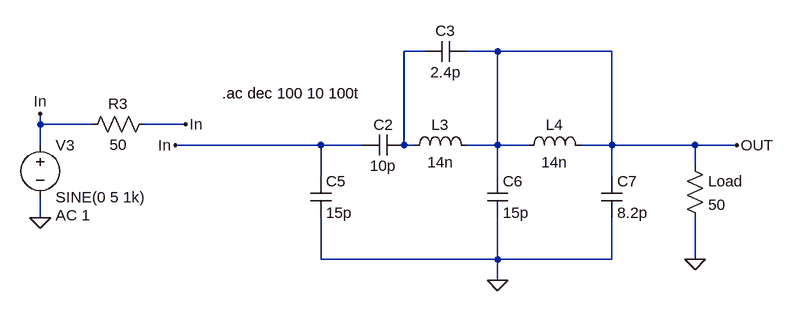
[diagram p0: schematic 433MHz filter with 14nH inductors.asc]
433MHz filter with 14nH inductors.asc, the LTspice schematic file:
Version 4
SHEET 1 2444 680
WIRE 752 32 720 32
WIRE 864 32 816 32
WIRE 1040 32 864 32
WIRE 160 144 160 128
WIRE 240 144 160 144
WIRE 384 144 320 144
WIRE 160 176 160 144
WIRE 592 176 368 176
WIRE 656 176 592 176
WIRE 720 176 720 32
WIRE 736 176 720 176
WIRE 864 176 864 32
WIRE 864 176 816 176
WIRE 912 176 864 176
WIRE 1040 176 1040 32
WIRE 1040 176 992 176
WIRE 1168 176 1040 176
WIRE 1232 176 1168 176
WIRE 1168 208 1168 176
WIRE 592 224 592 176
WIRE 864 224 864 176
WIRE 1040 224 1040 176
WIRE 160 288 160 256
WIRE 592 352 592 288
WIRE 864 352 864 288
WIRE 864 352 592 352
WIRE 1040 352 1040 288
WIRE 1040 352 864 352
WIRE 1168 352 1168 288
WIRE 864 384 864 352
FLAG 864 384 0
FLAG 1168 352 0
FLAG 160 288 0
FLAG 160 128 In
FLAG 384 144 In
FLAG 368 176 In
FLAG 1232 176 OUT
SYMBOL ind 720 192 R270
WINDOW 0 32 56 VTop 2
WINDOW 3 5 56 VBottom 2
SYMATTR InstName L3
SYMATTR Value 14n
SYMBOL ind 896 192 R270
WINDOW 0 32 56 VTop 2
WINDOW 3 5 56 VBottom 2
SYMATTR InstName L4
SYMATTR Value 14n
SYMBOL cap 576 224 R0
SYMATTR InstName C5
SYMATTR Value 15p
SYMBOL cap 848 224 R0
SYMATTR InstName C6
SYMATTR Value 15p
SYMBOL cap 1024 224 R0
SYMATTR InstName C7
SYMATTR Value 8.2p
SYMBOL cap 656 192 R270
WINDOW 0 32 32 VTop 2
WINDOW 3 0 32 VBottom 2
SYMATTR InstName C2
SYMATTR Value 10p
SYMBOL cap 752 48 R270
WINDOW 0 32 32 VTop 2
WINDOW 3 0 32 VBottom 2
SYMATTR InstName C3
SYMATTR Value 2.4p
SYMBOL res 1152 192 R0
SYMATTR InstName Load
SYMATTR Value 50
SYMBOL voltage 160 160 R0
WINDOW 123 24 124 Left 2
WINDOW 39 0 0 Left 2
SYMATTR Value2 AC 1
SYMATTR InstName V3
SYMATTR Value SINE(0 5 1k)
SYMBOL res 224 160 R270
WINDOW 0 32 56 VTop 2
WINDOW 3 0 56 VBottom 2
SYMATTR InstName R3
SYMATTR Value 50
TEXT 440 96 Left 2 !.ac dec 100 10 100t

The netlist it stands for:
* 433MHz filter with 14nH inductors.asc
L3 N001 OUT 14n
L4 OUT OUT 14n
C5 In 0 15p
C6 OUT 0 15p
C7 OUT 0 8.2p
C2 In N001 10p
C3 N001 OUT 2.4p
R§Load OUT 0 50
V3 In 0 SINE(0 5 1k) AC 1
R3 In In 50
.ac dec 100 10 100t
.backanno
.end